# EAGLE schematic Clock (EAGLE 7.2.0)
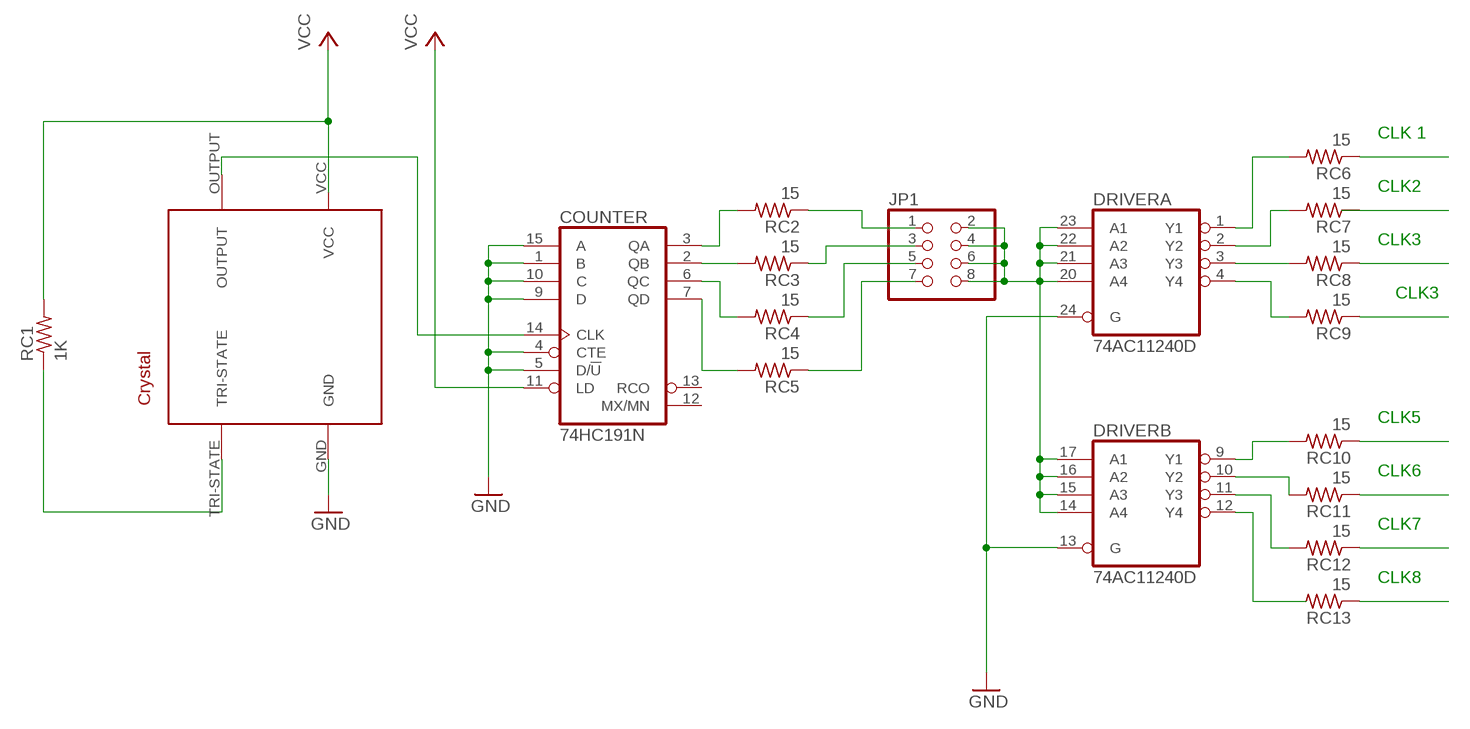
[diagram p0: schematic, sheet 1]

## Parts
COUNTER  74HC191N  [DIL16]
DRIVER  74AC11240D  [SO24W]
JP1  PINHD-2X4  [2X04]
RC1  1K  R-US_R0805  [R0805]
RC2  15  R-US_R0805  [R0805]
RC3  15  R-US_R0805  [R0805]
RC4  15  R-US_R0805  [R0805]
RC5  15  R-US_R0805  [R0805]
RC6  15  R-US_R0805  [R0805]
RC7  15  R-US_R0805  [R0805]
RC8  15  R-US_R0805  [R0805]
RC9  15  R-US_R0805  [R0805]
RC10  15  R-US_R0805  [R0805]
RC11  15  R-US_R0805  [R0805]
RC12  15  R-US_R0805  [R0805]
RC13  15  R-US_R0805  [R0805]
U$1  ECS-8FX  [ECS-8FX]

## Nets
GND: COUNTER.1(B) COUNTER.4(CTE) COUNTER.5(D/!U) COUNTER.9(D) COUNTER.10(C) COUNTER.15(A) DRIVER.13(B:G) DRIVER.24(A:G) U$1.GND
N$1: RC1.1 U$1.TRI-STATE
N$2: COUNTER.3(QA) RC2.2
N$3: COUNTER.14(CLK) U$1.OUTPUT
N$4: COUNTER.2(QB) RC3.2
N$5: COUNTER.6(QC) RC4.2
N$6: COUNTER.7(QD) RC5.2
N$7: JP1.1 RC2.1
N$8: JP1.5 RC4.1
N$9: JP1.3 RC3.1
N$10: JP1.7 RC5.1
N$11: DRIVER.14(B:A4) DRIVER.15(B:A3) DRIVER.16(B:A2) DRIVER.17(B:A1) DRIVER.20(A:A4) DRIVER.21(A:A3) DRIVER.22(A:A2) DRIVER.23(A:A1) JP1.2 JP1.4 JP1.6 JP1.8
N$12: DRIVER.9(B:Y1) RC10.2
N$13: DRIVER.1(A:Y1) RC6.2
N$14: DRIVER.2(A:Y2) RC7.2
N$15: DRIVER.3(A:Y3) RC8.2
N$16: DRIVER.4(A:Y4) RC9.2
N$17: RC6.1
N$19: RC8.1
N$20: RC9.1
N$21: DRIVER.10(B:Y2) RC11.2
N$22: DRIVER.11(B:Y3) RC12.2
N$23: DRIVER.12(B:Y4)
N$24: RC10.1
N$25: RC11.1
N$26: RC12.1
N$27: RC13.1
VCC: COUNTER.11(LD) RC1.2
Unconnected: COUNTER.12(MX/MN) COUNTER.13(RCO) RC7.1 RC13.2 U$1.VCC

## Notes on the sheet
- CLK 1
- CLK2
- CLK3
- CLK3
- CLK5
- CLK6
- CLK7
- CLK8

## Power pins joined to a net without a drawn wire
GND: COUNTER.8(GND) DRIVER.5(P:GND) DRIVER.6(P:GND) DRIVER.7(P:GND) DRIVER.8(P:GND)
VCC: COUNTER.16(VCC) DRIVER.18(P:VCC) DRIVER.19(P:VCC)

## Library data of the parts
COUNTER = 74xx-eu:74*191: Synchronous UP/DOWN COUNTER
DRIVER = 74ac-logic:74AC11240: Octal BUFFER/DRIVER
JP1 = adafruit:PINHD-2X4: PIN HEADER
RC1-RC13 = adafruit:R-US_: RESISTOR, American symbol
U$1 = Capstone:ECS-8FX: SMD Clock Oscillator